# Altium schematic sheet diferenciator.SchDoc
size A4
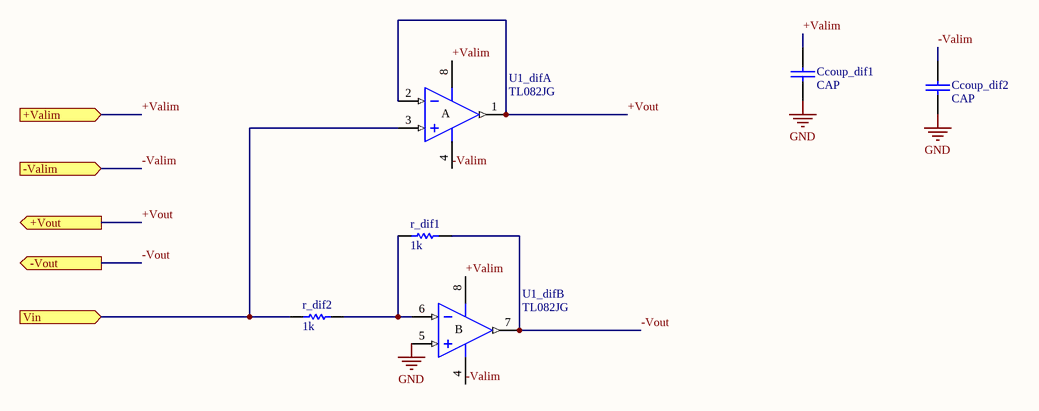
[diagram p0: diferenciator.SchDoc]

## Parts
Ccoup_dif1  CAP  [CAP200]
Ccoup_dif2  CAP  [CAP200]
r_dif1  1k  [RES300]
r_dif2  1k  [RES300]
U1_dif  TL082JG  [JG008]  (parts A,B of 2)

## Ports
+Valim (in), +Vout (out), -Valim (in), -Vout (out), Vin (in)

## Nets
GND: Ccoup_dif1.2 Ccoup_dif2.2 U1_dif.5(IN+)
+Valim: Ccoup_dif1.1 U1_dif.8(V+) ; port +Valim
+Vout: U1_dif.1(OUT) U1_dif.2(IN-) ; port +Vout
-Valim: Ccoup_dif2.1 U1_dif.4(V-) ; port -Valim
-Vout: r_dif1.2 U1_dif.7(OUT) ; port -Vout
Vin: r_dif2.1 U1_dif.3(IN+) ; port Vin
Netr_dif1_1: r_dif1.1 r_dif2.2 U1_dif.6(IN-)

## Notes on the sheet
- (in symbol TL082JG, part A) A
- (in symbol TL082JG, part B) B

## Library data of the parts
r_dif1 r_dif2 = RES
U1_dif = TL082JG: JFET-Input Operational Amplifier; Published: 16-Jan-2001; LatestRevisionDate: 04-Mar-2005; LatestRevisionNote: Stylized 3D Model Added.; DatasheetVersion: Feb-1999; PackageVersion: Jan-1995; PackageReference: JG008; Publisher: Altium Limited; PackageDescription: DIP; 8 Leads; Row Spacing 7.62 mm; Pitch 2.54 mm; ComponentLink1Description: Manufacturer Link; ComponentLink1URL: http://www.ti.com/; ComponentLink2Description: Datasheet; ComponentLink2URL: http://www-s.ti.com/sc/ds/tl082.pdf